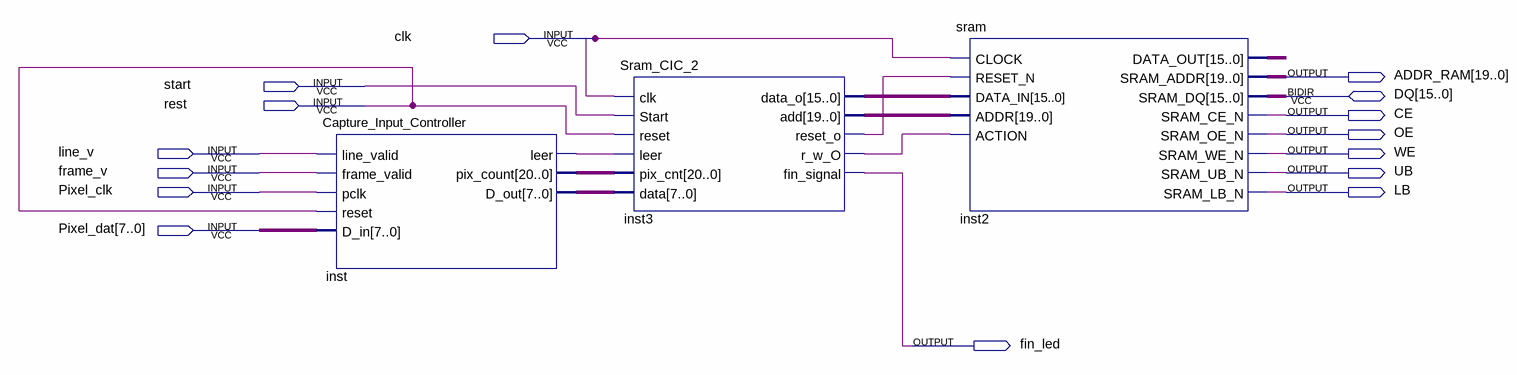
[diagram p0: schematic sheet]
// Quartus schematic Block1.bdf as structural Verilog: 3 symbols, 15 pins
module Block1 (
  input  clk,
  input  start,
  input  rest,
  input  line_v,
  input  frame_v,
  input  Pixel_clk,
  input  [7:0] Pixel_dat,
  inout  [15:0] DQ,
  output [19:0] ADDR_RAM,
  output CE,
  output OE,
  output WE,
  output UB,
  output LB,
  output fin_led
);

  wire inst3_r_w_o, inst3_reset_o, inst_leer;
  wire [7:0] inst_d_out;
  wire [15:0] inst2_data_out, inst3_data_o;
  wire [19:0] inst3_add;
  wire [20:0] inst_pix_count;

  Capture_Input_Controller inst (
    .line_valid(line_v), .frame_valid(frame_v), .pclk(Pixel_clk), .reset(rest), .D_in(Pixel_dat),
    .leer(inst_leer), .pix_count(inst_pix_count), .D_out(inst_d_out));
  Sram_CIC_2 inst3 (
    .clk(clk), .Start(start), .reset(rest), .leer(inst_leer), .pix_cnt(inst_pix_count), .data(inst_d_out),
    .data_o(inst3_data_o), .add(inst3_add), .reset_o(inst3_reset_o), .r_w_O(inst3_r_w_o), .fin_signal(fin_led));
  sram inst2 (
    .CLOCK(clk), .RESET_N(inst3_reset_o), .DATA_IN(inst3_data_o), .ADDR(inst3_add), .ACTION(inst3_r_w_o),
    .DATA_OUT(inst2_data_out), .SRAM_ADDR(ADDR_RAM), .SRAM_CE_N(CE), .SRAM_OE_N(OE), .SRAM_WE_N(WE),
    .SRAM_UB_N(UB), .SRAM_LB_N(LB), .SRAM_DQ(DQ));
endmodule
